# EAGLE design controller (EAGLE 7.4.0)
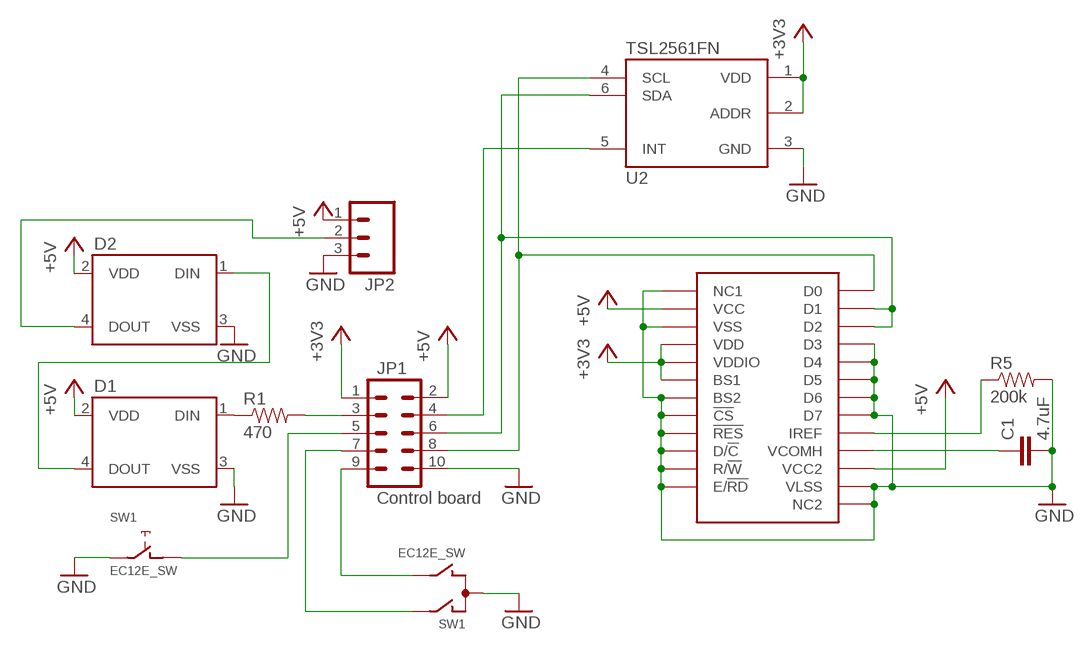
[diagram p0: schematic, sheet 1]

## Parts
C1  4.7uF  4.7UF-16V-20%,+80%-(1206)  [1206-CAP]
D1  WS2812BTHRU  [APA-106-F5]
D2  WS2812BTHRU  [APA-106-F5]
JP1  Control board  M05X2SHD_LOCK  [2X5-SHROUDED_LOCK]
JP2  M03LOCK  [1X03_LOCK]
R1  470  470OHM1/10W1%(0603)  [0603-RES]
R5  200k  300KOHM-1/10W-1%(0603)  [0603-RES]
SW1  EC12E_SW  [ALPS_EC12E_SW]
U2  TSL2561FN  [FN-6]
U$1  ER-OLED011  [ER-OLED011]

## Nets
+3V3: JP1.1 U2.1(VDD) U2.2(ADDR) U$1.BS1 U$1.VDD U$1.VDDIO
+5V: D1.2(VDD) D2.2(VDD) JP1.2 JP2.1 U$1.VCC U$1.VCC2
GND: C1.2 D1.3(VSS) D2.3(VSS) JP1.10 JP2.3 R5.2 SW1.C SW1.E U2.3(GND) U$1.!CS U$1.!RES U$1.BS2 U$1.D3 U$1.D4 U$1.D5 U$1.D6 U$1.D7 U$1.D/!C U$1.E/!RD U$1.NC1 U$1.NC2 U$1.R/!W U$1.VLSS U$1.VSS
N$1: D1.1(DIN) R1.1
N$2: D1.4(DOUT) D2.1(DIN)
N$3: JP1.3 R1.2
N$4: D2.4(DOUT) JP2.2
N$5: JP1.4 U2.5(INT)
N$6: JP1.7 SW1.A
N$8: JP1.9 SW1.B
N$9: JP1.5 SW1.D
N$10: R5.1 U$1.IREF
N$12: C1.1 U$1.VCOMH
N$14: JP1.6 U2.6(SDA) U$1.D1 U$1.D2
N$15: JP1.8 U2.4(SCL) U$1.D0
Unconnected: SW1.GND1(G) SW1.GND2(G)

## Library data of the parts
C1 = SparkFun-Capacitors:4.7UF-16V-20%,+80%-(1206): CAP-10300; PROD_ID: CAP-10300
D1 D2 = customized:WS2812B: WS2812B - Intelligent control LED integrated light source Technical Specifications: Power Supply Voltage (VDD): 3.5 to 5.3 V Input Voltage (VI): -0.5 to VDD+0.5 V Operating Junction Temperature (Topt): -25°C to +80°C Storage Temperature Range (Tstg): -55°C to +150°C
JP1 = SparkFun-Connectors:M05X2: Header 5x2 Standard 10-pin dual row 0.1" header. Commonly used with AVR-ISP. Use with Spark Fun Electronics SKU: PRT-00778
JP2 = SparkFun-Connectors:M03: Header 3 Standard 3-pin 0.1" header. Use with straight break away headers (SKU : PRT-00116), right angle break away headers (PRT-00553), swiss pins (PRT-00743), machine pins (PRT-00117), and female headers (PRT-00115). Molex polarized connector foot print use with SKU : PRT-08232 with associated crimp pins and housings.
R1 = SparkFun-Resistors:470OHM1/10W1%(0603): RES-07869; PROD_ID: RES-07869
R5 = SparkFun-Resistors:300KOHM-1/10W-1%(0603): RES-10809; PROD_ID: RES-10809; VALUE: 300k
SW1 = switch-alps:EC12E_SW: ALPS rotary Encoder EC12E series with switch; MPN: EC12E2424407; OC_FARNELL: 1520813; OC_NEWARK: 74M1068
U2 = SparkFun-DigitalIC:TSL2561: TSL2561 illumination sensor Approximates Human Eye Response Precisely Measures Illuminance Programmable Interrupt Function with User-Defined Upper and Lower Threshold 400 KHz I2C interface Programmable Analog Gain and Integration Time Supporting 1,000,000-to-1 Dynamic Range Automatically Rejects 50/60-Hz Lighting Ripple Low Active Power (0.75 mW Typical) with Power Down Mode RoHS Compliant The TSL2561 is a light-to-digital converter that transform light intensity to a digital signal output via I2C interface. The device combines one broadband photodiode (visible plus infrared) and one infrared-responding photodiode on a single CMOS integrated circuit capable of providing a near-photopic response over an effective 20-bit dynamic range (16-bit resolution). Two integrating ADCs convert the photodiode currents to a digital output that represents the irradiance measured on each channel. This digital output can be input to a microprocessor where illuminance (ambient light level) in lux is derived using an empirical formula to approximate the human eye response. The TSL2561 device supports a traditional level style interrupt that remains asserted until the firmware clears it.; PROD_ID: IC-11791
U$1 = ER-OLED:ER-OLED011

## Board
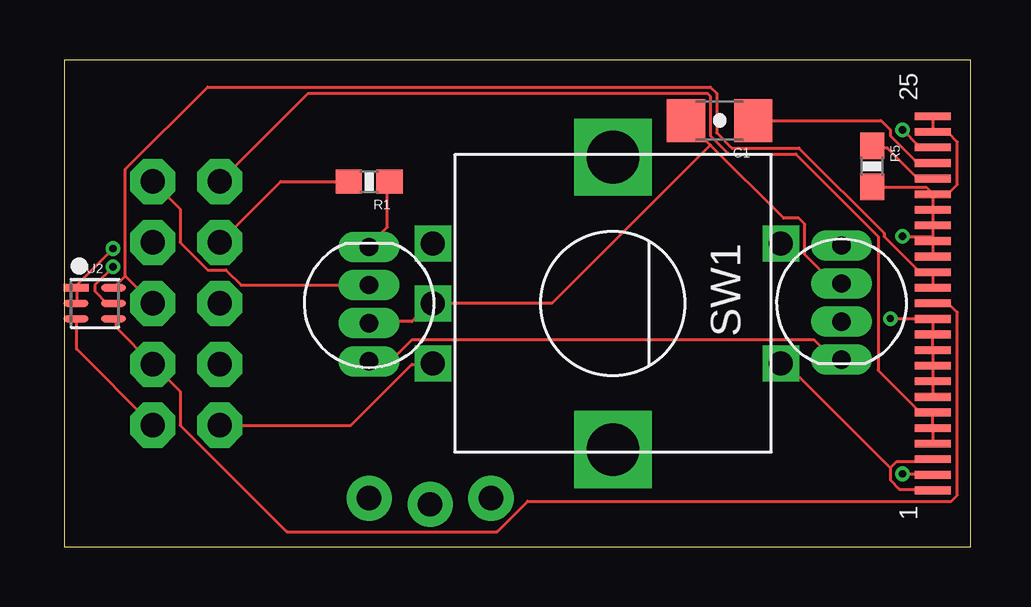
[diagram p1: board, top side]
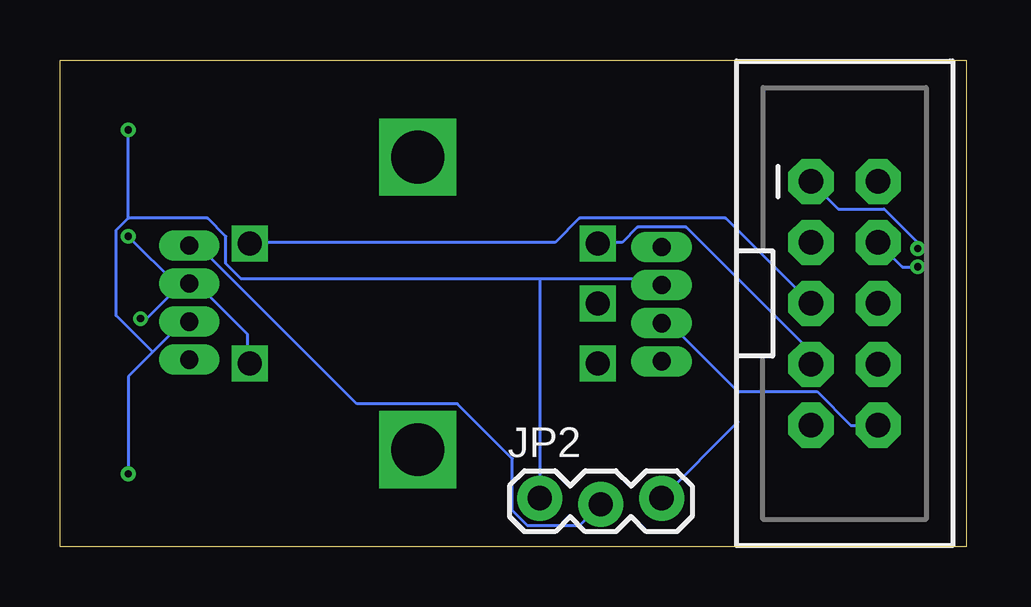
[diagram p2: board, bottom side, seen from below]

Size 37.77 x 20.31 mm. Coordinates in mm from the lower left corner, seen from the top.
Outline: 0,0 37.77,0 37.77,20.31 0,20.31 0,0
Copper layers (1*16): Top 0.035mm / dielectric 1.5mm / Bottom 0.035mm
Design rules "dirt_cheap_dirty_boards.v1": minimum track width 5mil, minimum drill 12mil, track to track 5mil, track to pad 5mil, pad to pad 5mil, via to via 5mil, smd to smd 0mil, copper to edge 10mil, drill to drill 10mil, minimum pad ring 10mil, minimum via ring 6mil, stop-mask expansion 2mil, vias tented up to drill 25mil, thermal gap 10mil

### Footprints (pad centres in the part's own frame; a part is rotated, then mirrored left to right if it is on the bottom)
1206-CAP = smd 1.6 x 1.8: 1 -1.4,0; 2 1.4,0
APA-106-F5 = drill 0.762 pad 0.813 long: 1 2.349,0; 2 0.762,0; 3 -0.826,0; 4 -2.413,0
2X5-SHROUDED_LOCK = drill 1.016 pad 1.88 octagon: 1 -1.397,5.08; 2 1.397,5.08; 3 -1.397,2.54; 4 1.397,2.54; 5 -1.397,0; 6 1.397,0; 7 -1.397,-2.54; 8 1.397,-2.54; 9 -1.397,-5.08; 10 1.397,-5.08
1X03_LOCK = drill 1.016 pad 1.88: 1 0,0.127; 2 2.54,-0.127; 3 5.08,0.127
0603-RES = smd 1.1 x 1: 1 -0.85,0; 2 0.85,0
ALPS_EC12E_SW = drill 1 square: A -2.5,-7.5; B 2.5,-7.5; C 0,-7.5; D -2.5,7; E 2.5,7 | drill 2.2 square: GND1 -6.1,0; GND2 6.1,0
FN-6 = smd 1.05 x 0.3: 1 -0.775,0.65; 2 -0.775,0; 3 -0.775,-0.65; 4 0.775,-0.65; 5 0.775,0; 6 0.775,0.65
ER-OLED011 = smd 0.32 x 1.5: !CS -3.25,0; !RES -2.6,0; BS1 -4.55,0; BS2 -3.9,0; D0 0,0; D1 0.65,0; D2 1.3,0; D3 1.95,0; D4 2.6,0; D5 3.25,0; D6 3.9,0; D7 4.55,0; D/!C -1.95,0; E/!RD -0.65,0; IREF 5.2,0; NC1 -7.8,0; NC2 7.8,0; R/!W -1.3,0; VCC -7.15,0; VCC2 6.5,0; VCOMH 5.85,0; VDD -5.85,0; VDDIO -5.2,0; VLSS 7.15,0; VSS -6.5,0

### Placement (x,y rotation side)
C1  27.3,17.78 180 top
D1  12.7,10.16 90 top
D2  32.38,10.16 270 top
JP1  5.08,10.16 0 bottom
JP2  17.78,1.91 0 bottom
R1  12.7,15.24 180 top
R5  33.66,15.88 270 top
SW1  22.86,10.16 270 top
U2  1.27,10.16 0 top
U$1  36.2,10.16 90 top

### Tracks (layer width: path | path; a pad name or v marks a point on that pad's centre or on a via)
+3V3  (via drill 0.3)
  Top 0.127: U$1.VDD U$1.VDDIO U$1.BS1 36.2,5.71 35.56,5.71 33.91,7.37 33.91,12.95 30.48,16.38 27.69,16.38 26.92,17.14 26.92,18.8 26.8,18.92 10.16,18.92 JP1.1 | U2.2 0.51,10.16 0.51,10.79 U2.1 0.51,10.92 v2.03,12.45
  Bottom 0.127: v2.03,12.45 2.03,12.7 3.43,14.1 5.33,14.1 JP1.1
+5V  (via drill 0.3)
  Top 0.127: v34.92,3.05 36.2,3.05 U$1.VCC | v34.92,17.4 35.56,16.76 36.2,16.76 U$1.VCC2 | D1.2 7.37,10.92 6.73,11.56 5.97,11.56 4.83,12.7 4.83,14.1 JP1.2
  Bottom 0.127: v34.92,3.05 34.92,7.11 33.91,8.13 | 33.91,8.13 32.64,9.4 D2.2 | 34.92,13.72 v34.92,17.4 | 34.92,13.72 35.43,13.21 35.43,9.65 33.91,8.13 | 34.92,13.72 31.62,13.72 30.86,12.95 30.86,11.81 30.23,11.18 17.78,11.18 | 17.78,11.18 12.95,11.18 D1.2 | 17.78,11.18 JP2.1
GND  (via drill 0.3)
  Top 0.127: D1.3 12.7,9.4 14.48,9.4 15.24,10.16 SW1.C 20.32,10.16 26.92,16.76 | 34.42,3.3 34.42,2.79 34.8,2.41 36.2,2.41 U$1.NC1 | 34.42,3.3 34.67,3.56 36.2,3.56 U$1.VSS | 34.42,3.3 29.97,7.75 SW1.E | U$1.D3 U$1.D4 36.2,12.95 | 36.2,12.95 U$1.D5 U$1.D6 U$1.D7 36.2,14.73 | U$1.NC2 U$1.VLSS 36.2,17.27 36.83,17.27 37.21,16.89 37.21,15.11 36.83,14.73 36.2,14.73 | 36.2,14.73 35.94,14.99 33.66,14.99 R5.2 | U$1.BS2 U$1.!CS U$1.!RES U$1.D/!C U$1.R/!W U$1.E/!RD 36.2,9.53 v34.42,9.53 | 26.92,16.76 29.97,13.72 30.61,13.72 30.86,13.46 30.86,12.19 32,11.05 32.38,11.05 D2.3 | 26.92,16.76 C1.2 | v34.92,12.95 36.2,12.95 | JP1.10 0.51,8.26 0.51,9.4 U2.3
  Bottom 0.127: JP1.10 4.83,5.08 6.22,6.48 9.53,6.48 | 9.53,6.48 12.32,9.27 12.7,9.27 D1.3 | v34.42,9.53 34.16,9.53 32.77,10.92 | 32.38,10.92 32.77,10.92 | v34.92,12.95 32.89,10.92 32.77,10.92 | 32.77,10.92 D2.3 32.38,10.92 | 32.38,10.92 32,10.92 29.97,8.89 29.97,7.75 SW1.E | 9.53,6.48 9.53,5.21 JP2.3
N$1
  Top 0.127: R1.1 13.46,15.24 13.46,13.34 12.7,12.57 D1.1
N$2
  Top 0.127: D1.4 13.59,7.75 14.48,8.64 31.24,8.64 32,7.87 32.38,7.87 D2.1
N$3
  Top 0.127: R1.2 9.02,15.24 JP1.3
N$4
  Bottom 0.127: D2.4 32,12.57 25.4,5.97 21.21,5.97 18.92,3.68 18.92,1.52 18.29,0.89 16.13,0.89 JP2.2
N$5  (via drill 0.3)
  Top 0.127: U2.5 1.78,10.16 1.27,10.67 1.27,10.92 v2.03,11.68
  Bottom 0.127: v2.03,11.68 2.67,11.68 JP1.4
N$6
  Bottom 0.127: JP1.7 6.48,8.13 11.68,13.34 13.72,13.34 14.35,12.7 15.24,12.7 SW1.A
N$8
  Top 0.127: JP1.9 11.94,5.08 14.48,7.62 15.24,7.62 SW1.B
N$9
  Bottom 0.127: JP1.5 10.03,13.72 16.13,13.72 17.14,12.7 29.84,12.7 SW1.D
N$10
  Top 0.127: R5.1 33.66,16.64 34.29,16.64 35.56,15.37 U$1.IREF
N$12
  Top 0.127: C1.1 34.04,17.78 34.42,17.4 34.42,17.14 35.43,16.13 36.2,16.13 U$1.VCOMH
N$14
  Top 0.127: U$1.D1 U$1.D2 36.2,11.56 35.56,11.56 34.16,12.95 34.16,13.08 30.61,16.64 27.81,16.64 27.18,17.27 27.18,18.92 26.92,19.18 5.97,19.18 2.54,15.75 2.54,11.3 | JP1.6 2.54,11.3 | 2.54,11.3 2.16,10.92 U2.6
N$15
  Top 0.127: U$1.D0 36.83,10.16 37.21,9.78 37.21,2.16 36.96,1.91 19.3,1.91 18.03,0.64 9.27,0.64 4.83,5.08 4.83,6.48 JP1.8 2.16,9.14 2.16,9.4 U2.4